# Altium project MiniSumo2 UI.PrjPcb
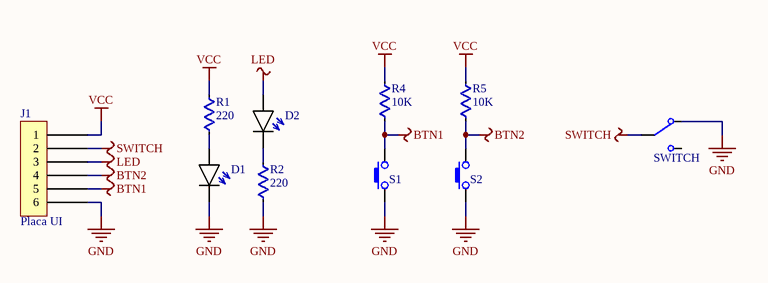
[diagram p0: UI.SchDoc]
1 sheet, 10 parts. Net scope: global (net labels, ports and power ports of the same name join across sheets).
Board file: UI.PcbDoc

## Sheet UI.SchDoc
size A4; PageSetup: Record=PageOptions|CenterHorizontal=True|CenterVertical=True|PrintScale=1.00|XCorrection=1.00|YCorrection=1.00|PrintKind=0|BorderSize=5000000|LeftOffset=0|BottomOffset=0|Orientation=2|PaperLength=1000|PaperWidth=1000|Scale=100|PaperSource=7|PrintQuality=-3|MediaType=1|DitherType=10|PrintScaleMode=1|PaperKind=A4|PaperIndex=9

### Parts
D1  LED  [LED-3MM-YELLOW]  (value not drawn)
D2  LED  [LED-3MM-RED]  (value not drawn)
J1  Placa UI  [Header 1x6]
R1  value 220  [RES-Axial-400mil]  (hidden comment: RES)
R2  value 220  [RES-Axial-400mil]  (hidden comment: RES)
R4  value 10K  [RES-Axial-400mil]  (hidden comment: RES)
R5  value 10K  [RES-Axial-400mil]  (hidden comment: RES)
S1  BUTTON  [TACT_SWITCH-SMALL-4PIN]  (value not drawn)
S2  BUTTON  [TACT_SWITCH-SMALL-4PIN]  (value not drawn)
SWITCH  SLIDE-SWITCH  [SWITCH]  (value not drawn)

### Nets
BTN1: J1.5 R4.1 S1.2
BTN2: J1.4 R5.1 S2.2
GND: D1.K J1.6 R2.1 S1.1 S2.1 SWITCH.1
LED: D2.A J1.3
SWITCH: J1.2 SWITCH.2
VCC: J1.1 R1.2 R4.2 R5.2
NetD1_A: D1.A R1.1
NetD2_K: D2.K R2.2

Not connected (* = marked no-connect by the designer): SWITCH 3

### Library data of the parts
J1 = Header 1x6